# EAGLE design chimera (EAGLE 7.5.0)
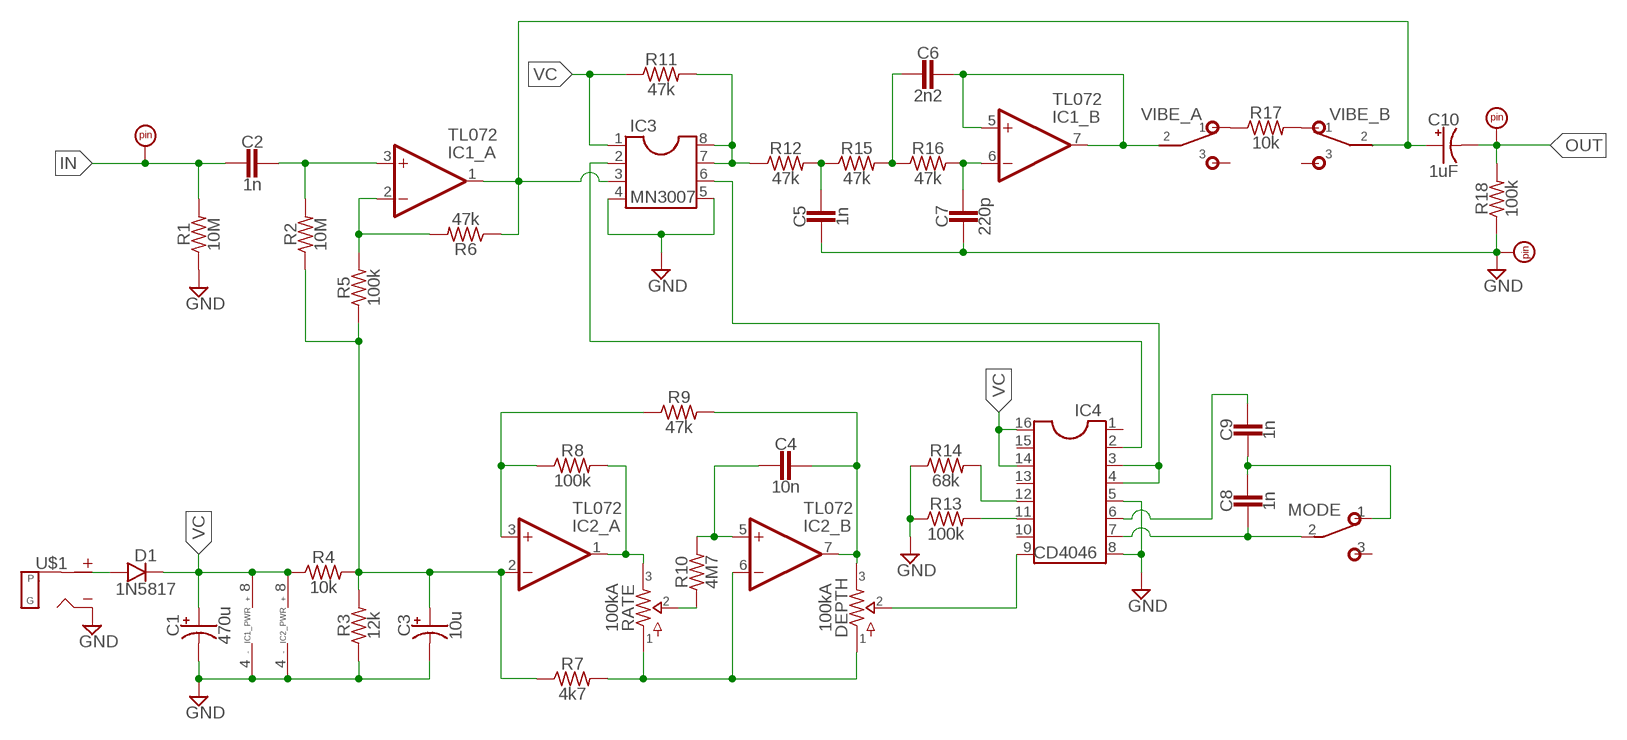
[diagram p0: schematic, sheet 1]

## Parts
C1  470u  0801  [080_035]
C2  1n  CER/FILM2  [050X030_025_2]
C3  10u  0501  [050_020_1]
C4  10n  CER/FILMBOX.2  [BOX_MED]
C5  1n  CER/FILM2  [050X030_025_2]
C6  2n2  CER/FILM2  [050X030_025_2]
C7  220p  CER/FILM2  [050X030_025_2]
C8  1n  CER/FILM2  [050X030_025_2]
C9  1n  CER/FILM2  [050X030_025_2]
C10  1uF  0801  [080_035]
D1  1N5817  DO41.2  [DO41-2]
DEPTH  100kA  POTS16MM  [16MM]
GND  PADRND  [ROUND]
IC1  TL072  DUALTH  [DIL08]
IC2  TL072  DUALTH  [DIL08]
IC3  MN3007  DIL8  [DIL08]
IC4  CD4046  DIL16  [DIL16]
IN  PADSQR  [SQUARE]
MODE  SPDTPIN_MOUNT  [1MS1T1B1C0M2QE]
OUT  PADSQR  [SQUARE]
R1  10M  R_.3B  [R0207/3]
R2  10M  R_.3B  [R0207/3]
R3  12k  R_.3B  [R0207/3]
R4  10k  R_.3B  [R0207/3]
R5  100k  R_.3B  [R0207/3]
R6  47k  R_.3B  [R0207/3]
R7  4k7  R_.3B  [R0207/3]
R8  100k  R_.3B  [R0207/3]
R9  47k  R_.3B  [R0207/3]
R10  4M7  R_.3B  [R0207/3]
R11  47k  R_.3B  [R0207/3]
R12  47k  R_.3B  [R0207/3]
R13  100k  R_.3B  [R0207/3]
R14  68k  R_.3B  [R0207/3]
R15  47k  R_.3B  [R0207/3]
R16  47k  R_.3B  [R0207/3]
R17  10k  R_.3B  [R0207/3]
R18  100k  R_.3B  [R0207/3]
RATE  100kA  POTS16MM  [16MM]
U$1  DC_MONO  [DC]
VIBE  DPDTTAIWAY1MD  [TAIWAY1MD]

## Nets
GND: C1.- C3.- C5.1 C7.2 GND.1 IC1.4(_PWR:V-) IC2.4(_PWR:V-) IC3.4 IC3.5 IC4.5 IC4.8 R1.1 R3.1 R13.1 R14.1 R18.1 U$1.S(SLEEVE)
IN: C2.1 IN.1 R1.2
N$1: C2.2 IC1.3(_A:+IN) R2.2
N$2: IC1.2(_A:-IN) R5.2 R6.2
N$3: C10.+ IC1.1(_A:OUT) IC3.3 R6.1 VIBE.B2
N$4: DEPTH.1 IC2.6(_B:-IN) R7.2 RATE.1
N$5: C4.2 IC2.5(_B:+IN) R10.2
N$6: R17.1 VIBE.A1
N$7: IC2.3(_A:+IN) R8.1 R9.1
N$8: IC2.1(_A:OUT) R8.2 RATE.3
N$9: DEPTH.2 IC4.9
N$10: C4.1 DEPTH.3 IC2.7(_B:OUT) R9.2
N$11: R10.1 RATE.2
N$12: IC4.11 R13.2
N$13: IC4.12 R14.2
N$14: C8.1 IC4.7 MODE.2(P)
N$15: IC3.2 IC4.2
N$16: IC3.7 IC3.8 R11.2 R12.1
N$17: C7.1 IC1.6(_B:-IN) R16.2
N$18: C5.2 R12.2 R15.1
N$19: C6.2 R15.2 R16.1
N$20: C6.1 IC1.5(_B:+IN) IC1.7(_B:OUT) VIBE.A2
N$21: C9.2 IC4.6
N$22: IC3.6 IC4.3 IC4.4
N$23: R17.2 VIBE.B1
N$24: C8.2 C9.1 MODE.1(O)
N$26: C3.+ IC2.2(_A:-IN) R2.1 R3.2 R4.2 R5.1 R7.1
N$29: D1.A U$1.T(TIP)
OUT: C10.- OUT.1 R18.2
VC: C1.+ D1.C IC1.8(_PWR:V+) IC2.8(_PWR:V+) IC3.1 IC4.14 IC4.16 R4.1 R11.1
Unconnected: IC4.1 IC4.10 IC4.13 IC4.15 MODE.3(S) VIBE.A3 VIBE.B3

## Library data of the parts
C1 C10 = capacitors-elec:080: 47 - 470uF Xicon values at Mouser.com 10V: 330, 470uF; 16V: 220, 330uF; 25V: 220uF; 50V: 47, 100uF
C2 C4-C9 = capacitors-film:CER/FILM: 47 - 120pF Xicon Ceramic Disc 2.5mm lead spacing
C3 = capacitors-elec:050: 0.22 - 100uF Xicon values at Mouser.com: 10V: 10 - 100uF; 16V: 2.2 - 47uF; 25V: 0.47 - 47uF; 50V: 0.22 - 22uF
D1 = diodes:DO41: DO-41 Package Diodes: 1N4001 - 1N40019 Zener Diodes: 1N4728 - 1N4764
DEPTH RATE = potentiometers:POTS
GND IN OUT = supply pins:PAD
IC1 IC2 = integrated circuits:DUAL: OP AMP
IC3 = integrated circuits:DIL8: Dual In Line
IC4 = integrated circuits:DIL16
MODE = switches:SPDT: TOGGLE SWITCH Marquardt
R1-R18 = resistors:R_
U$1 = jacks:DC_MONO
VIBE = switches:DPDT

## Board
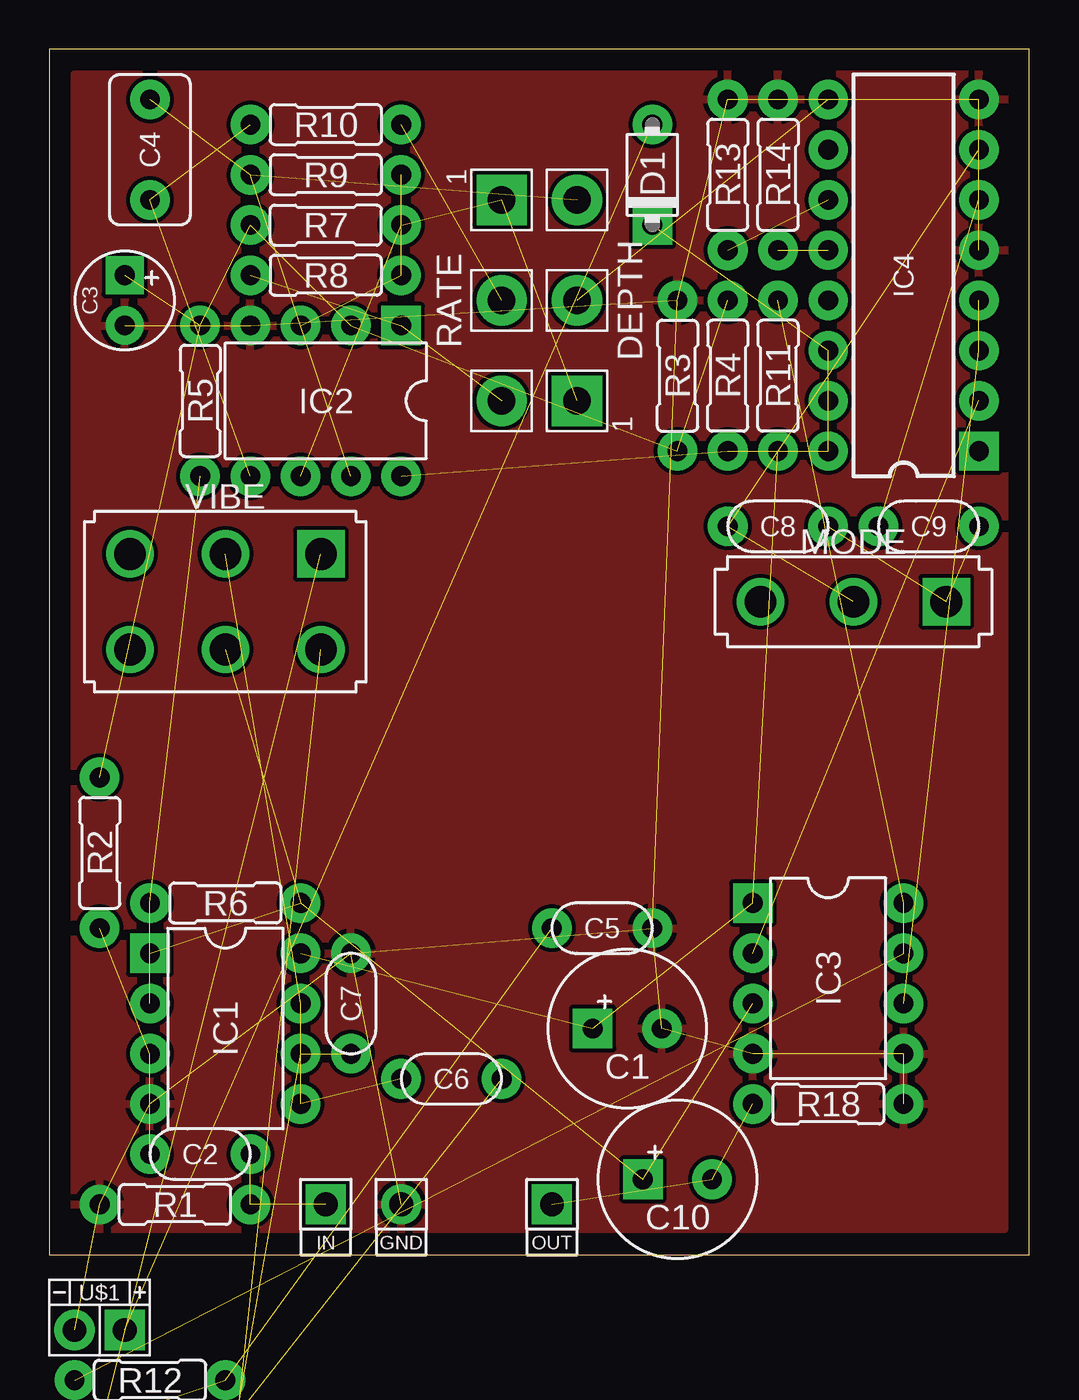
[diagram p1: board, top side]
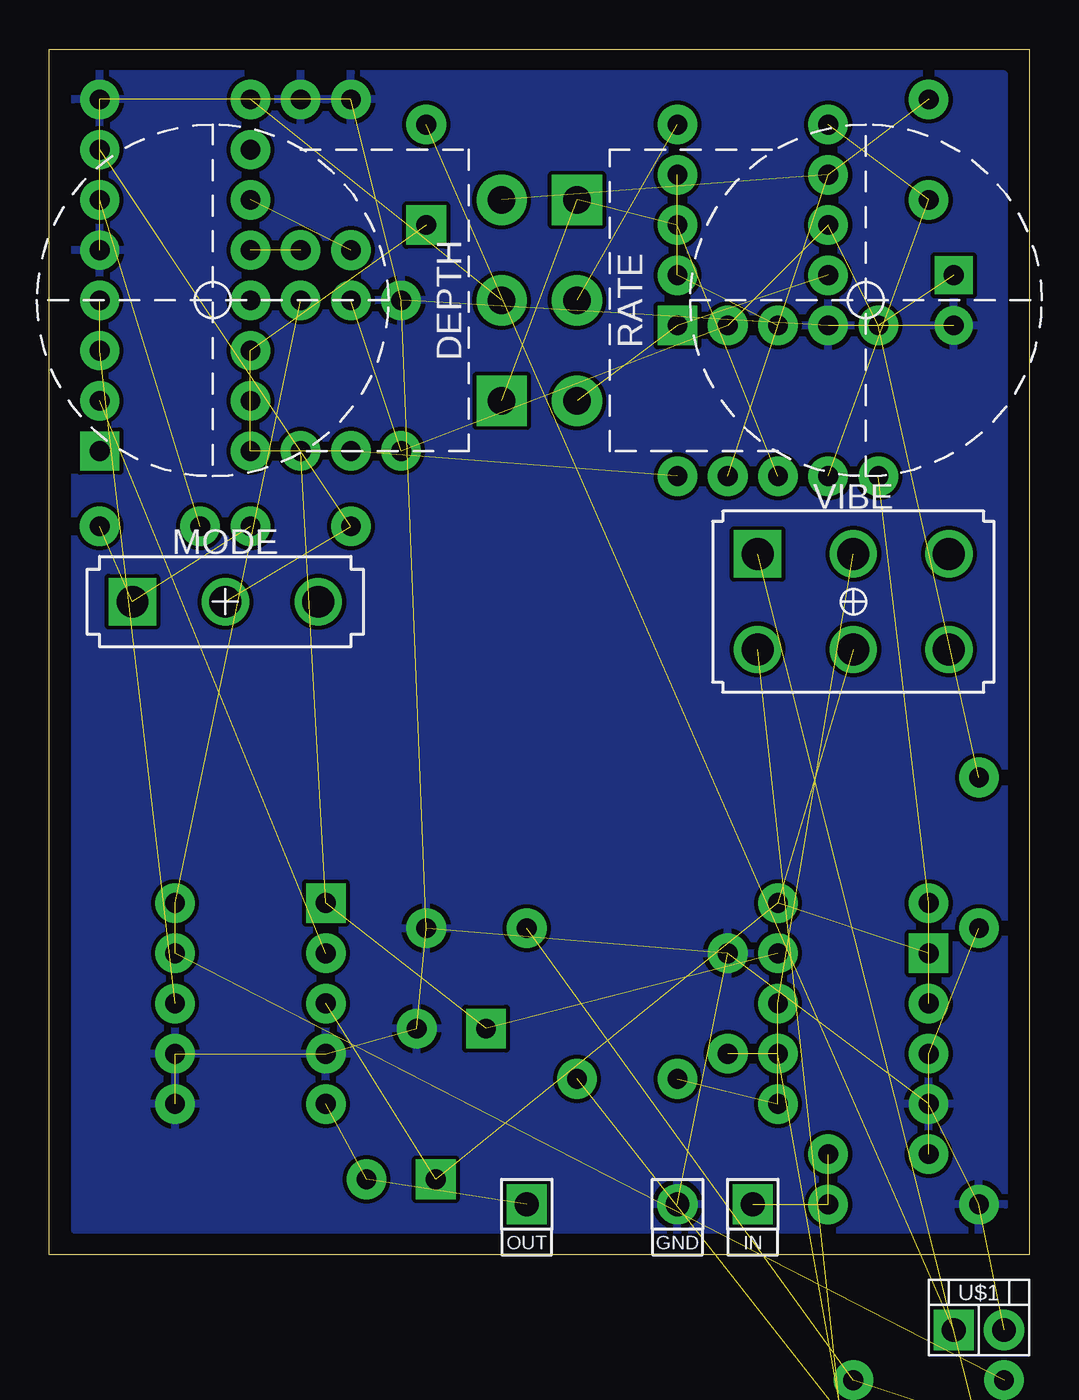
[diagram p2: board, bottom side, seen from below]

Size 49.53 x 60.95 mm. Coordinates in mm from the lower left corner, seen from the top.
Outline: 0,0 49.53,0 49.53,60.95 0,60.95 0,0
Copper layers (1*16): Top 0.035mm / dielectric 1.5mm / Bottom 0.035mm
Design rules "default": minimum track width 10mil, minimum drill 24mil, track to track 8mil, track to pad 8mil, pad to pad 8mil, via to via 8mil, smd to smd 8mil, copper to edge 40mil, drill to drill 8mil, minimum pad ring 10mil, minimum via ring 8mil, stop-mask expansion 4mil, vias tented up to drill 0mil, thermal gap 10mil

### Footprints (pad centres in the part's own frame; a part is rotated, then mirrored left to right if it is on the bottom)
080_035 = drill 1 pad 2 square: + -1.75,0 | drill 1 pad 2: - 1.75,0
050X030_025_2 = drill 1 pad 2: 1 -2.54,0; 2 2.54,0
050_020_1 = drill 1 pad 1.93 square: + -1.27,0 | drill 1 pad 1.93: - 1.27,0
BOX_MED = drill 1 pad 2: 1 -2.54,0; 2 2.54,0
DO41-2 = drill 1 pad 2: A 2.54,0 | drill 1 pad 2 square: C -2.54,0
16MM = drill 1.4 pad 2.54 square: 1 5.08,0 | drill 1.4 pad 2.54: 2 0,0; 3 -5.08,0
ROUND = drill 1.2 pad 2.032: 1 0,0
DIL08 = drill 1 pad 2 square: 1 -3.81,-3.81 | drill 1 pad 2: 2 -1.27,-3.81; 3 1.27,-3.81; 4 3.81,-3.81; 5 3.81,3.81; 6 1.27,3.81; 7 -1.27,3.81; 8 -3.81,3.81
DIL16 = drill 1 pad 1.981 square: 1 -8.89,-3.81 | drill 1 pad 1.981: 2 -6.35,-3.81; 3 -3.81,-3.81; 4 -1.27,-3.81; 5 1.27,-3.81; 6 3.81,-3.81; 7 6.35,-3.81; 8 8.89,-3.81; 9 8.89,3.81; 10 6.35,3.81; 11 3.81,3.81; 12 1.27,3.81; 13 -1.27,3.81; 14 -3.81,3.81; 15 -6.35,3.81; 16 -8.89,3.81
SQUARE = drill 1.2 pad 2.032 square: 1 0,0
1MS1T1B1C0M2QE = drill 1.6 square: 1 4.699,0 | drill 1.6: 2 0,0; 3 -4.699,0
R0207/3 = drill 1 pad 2: 1 -3.81,0; 2 3.81,0
DC = drill 1.2 pad 2.032: S -1.27,0 | drill 1.2 pad 2.032 square: T 1.27,0
TAIWAY1MD = drill 1.6 square: A1 -2.413,4.834 | drill 1.6: A2 -2.413,0.004; A3 -2.413,-4.826; B1 2.417,4.834; B2 2.417,0.004; B3 2.417,-4.826

### Placement (x,y rotation side)
C1  29.21,11.43 0 top
C2  7.62,5.08 180 top
C3  3.81,48.26 270 top
C4  5.08,55.88 270 top
C5  27.94,16.51 180 top
C6  20.32,8.89 0 top
C7  15.24,12.7 90 top
C8  36.83,36.83 0 top
C9  44.45,36.83 180 top
C10  31.75,3.81 0 top
D1  30.48,54.61 90 top
DEPTH  26.67,48.26 270 top
GND  17.78,2.54 0 top
IC1  8.89,11.43 270 top
IC2  13.97,43.18 180 top
IC3  39.37,13.97 270 top
IC4  43.18,49.53 90 top
IN  13.97,2.54 0 top
MODE  40.64,33.02 0 top
OUT  25.4,2.54 0 top
R1  6.35,2.54 0 top
R2  2.54,20.32 270 top
R3  31.75,44.45 270 top
R4  34.29,44.45 90 top
R5  7.62,43.18 270 top
R6  8.89,17.78 180 top
R7  13.97,52.07 0 top
R8  13.97,49.53 180 top
R9  13.97,54.61 180 top
R10  13.97,57.15 180 top
R11  36.83,44.45 90 top
R12  5.08,-6.35 0 top  (outside the outline)
R13  34.29,54.61 270 top
R14  36.83,54.61 270 top
R15  5.08,-8.89 0 top  (outside the outline)
R16  5.08,-11.43 0 top  (outside the outline)
R17  5.08,-13.97 0 top  (outside the outline)
R18  39.37,7.62 180 top
RATE  22.86,48.26 90 top
U$1  2.54,-3.81 0 top  (outside the outline)
VIBE  8.89,33.02 270 top

### Tracks (layer width: path | path; a pad name or v marks a point on that pad's centre or on a via)
GND  (16 unrouted)
  pour Bottom: 1.27,59.69 48.26,59.69 48.26,1.27 1.27,1.27
  pour Top: 1.27,59.69 48.26,59.69 48.26,1.27 1.27,1.27
IN  (2 unrouted)
N$1  (2 unrouted)
N$2  (2 unrouted)
N$3  (4 unrouted)
N$4  (3 unrouted)
N$5  (2 unrouted)
N$6  (1 unrouted)
N$7  (2 unrouted)
N$8  (2 unrouted)
N$9  (1 unrouted)
N$10  (3 unrouted)
N$11  (1 unrouted)
N$12  (1 unrouted)
N$13  (1 unrouted)
N$14  (2 unrouted)
N$15  (1 unrouted)
N$16  (3 unrouted)
N$17  (2 unrouted)
N$18  (2 unrouted)
N$19  (2 unrouted)
N$20  (3 unrouted)
N$21  (1 unrouted)
N$22  (2 unrouted)
N$23  (1 unrouted)
N$24  (2 unrouted)
N$26  (6 unrouted)
N$29  (1 unrouted)
OUT  (2 unrouted)
VC  (8 unrouted)